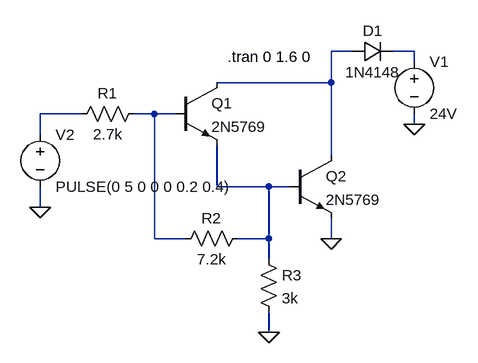
[diagram p0: schematic darlington.asc]
darlington.asc, the LTspice schematic file:
Version 4
SHEET 1 880 680
WIRE 272 32 240 32
WIRE 368 32 336 32
WIRE 368 48 368 32
WIRE 240 80 240 32
WIRE 240 80 64 80
WIRE -144 128 -208 128
WIRE -32 128 -64 128
WIRE 0 128 -32 128
WIRE 368 144 368 128
WIRE -208 160 -208 128
WIRE 240 192 240 80
WIRE 64 240 64 176
WIRE 144 240 64 240
WIRE 176 240 144 240
WIRE -208 272 -208 240
WIRE -32 320 -32 128
WIRE 16 320 -32 320
WIRE 144 320 144 240
WIRE 144 320 96 320
WIRE 240 320 240 288
WIRE 144 352 144 320
WIRE 144 464 144 432
FLAG 144 464 0
FLAG 368 144 0
FLAG -208 272 0
FLAG 240 320 0
SYMBOL npn 0 80 R0
SYMATTR InstName Q1
SYMATTR Value 2N5769
SYMBOL npn 176 192 R0
SYMATTR InstName Q2
SYMATTR Value 2N5769
SYMBOL res -160 144 R270
WINDOW 0 32 56 VTop 2
WINDOW 3 0 56 VBottom 2
SYMATTR InstName R1
SYMATTR Value 2.7k
SYMBOL res 0 336 R270
WINDOW 0 32 56 VTop 2
WINDOW 3 0 56 VBottom 2
SYMATTR InstName R2
SYMATTR Value 7.2k
SYMBOL res 128 336 R0
SYMATTR InstName R3
SYMATTR Value 3k
SYMBOL diode 272 48 R270
WINDOW 0 32 32 VTop 2
WINDOW 3 0 32 VBottom 2
SYMATTR InstName D1
SYMATTR Value 1N4148
SYMBOL voltage 368 32 R0
WINDOW 123 0 0 Left 2
WINDOW 39 0 0 Left 2
SYMATTR InstName V1
SYMATTR Value 24V
SYMBOL voltage -208 144 R0
WINDOW 123 0 0 Left 2
WINDOW 39 0 0 Left 2
SYMATTR InstName V2
SYMATTR Value PULSE(0 5 0 0 0 0.2 0.4)
TEXT 80 40 Left 2 !.tran 0 1.6 0

The netlist it stands for:
* darlington.asc
Q1 N001 N004 N005 0 2N5769
Q2 N001 N005 0 0 2N5769
R1 N003 N004 2.7k
R2 N004 N005 7.2k
R3 N005 0 3k
D1 N001 N002 1N4148
V1 N002 0 24V
V2 N003 0 PULSE(0 5 0 0 0 0.2 0.4)
.model D D
.lib standard.dio
.model NPN NPN
.model PNP PNP
.lib standard.bjt
.tran 0 1.6 0
.backanno
.end